# Altium schematic sheet BPF.SchDoc: BPF
size A2 portrait; DocumentNumber: 14; Revision: 1.8.2; SheetNumber: 14; SheetTotal: 19; DocumentName: Лист 1.SCHDOC
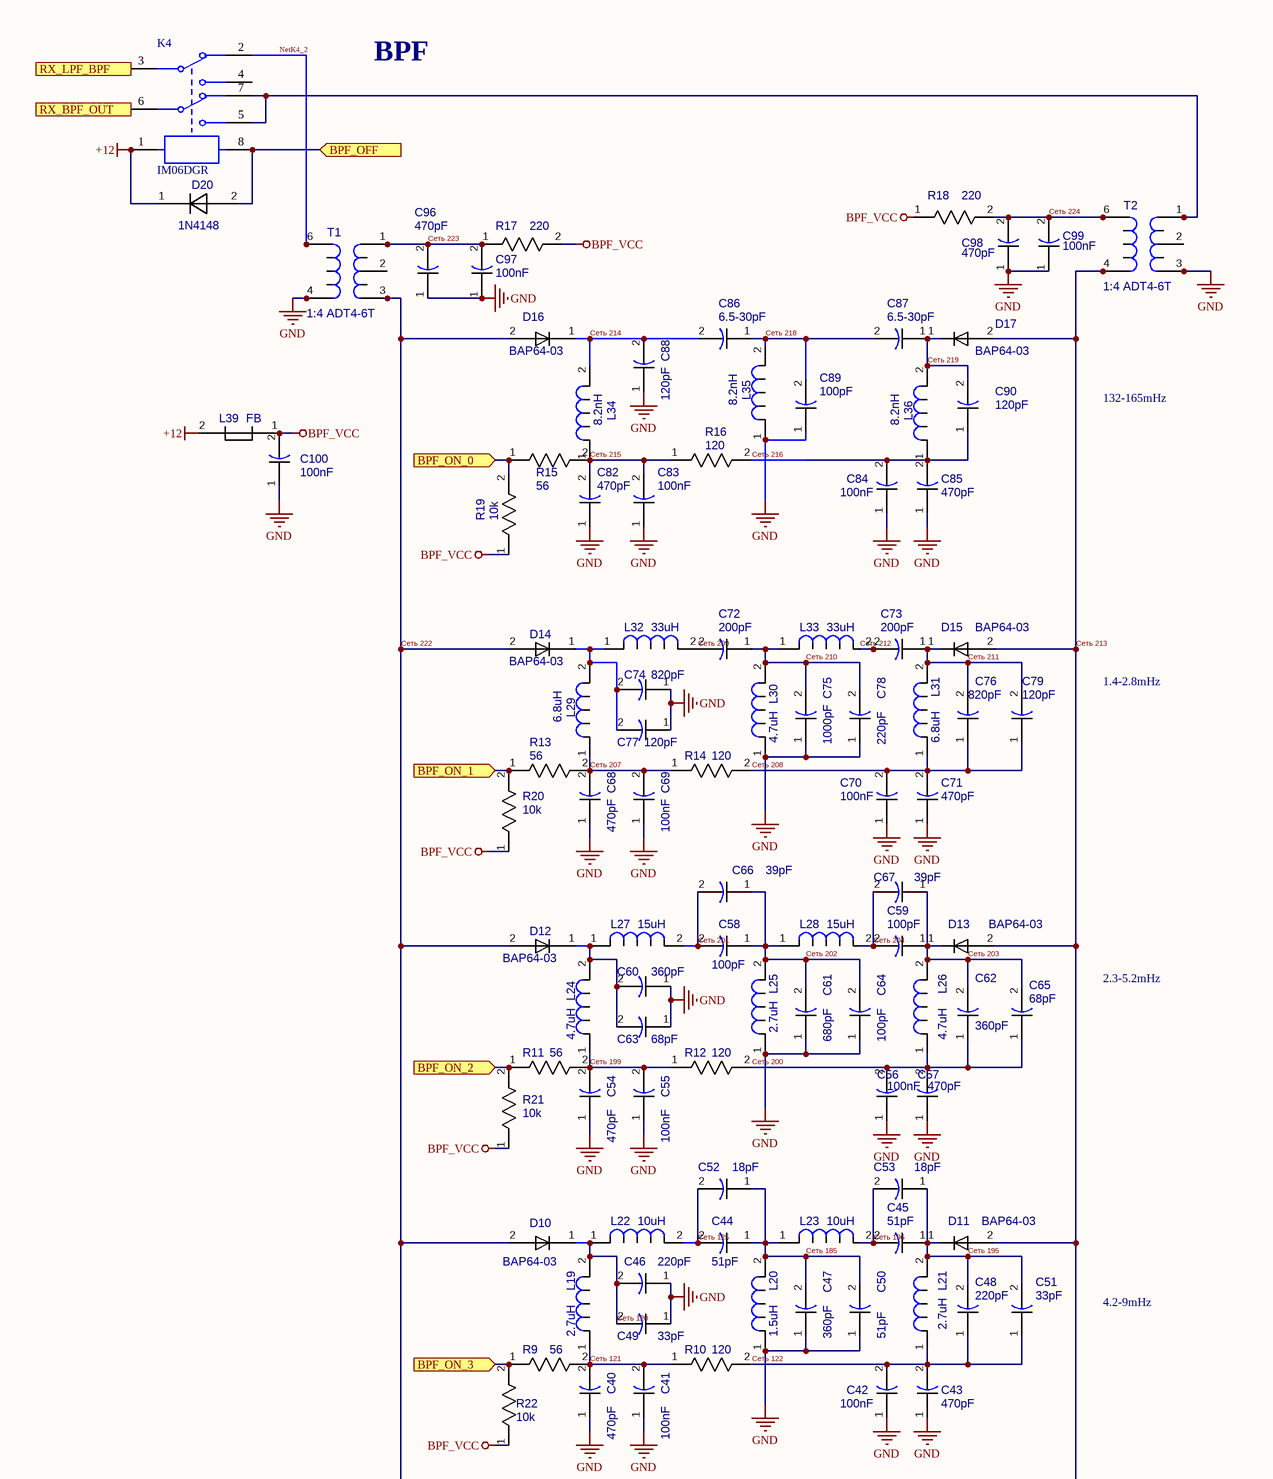
[diagram p0: BPF.SchDoc, top]
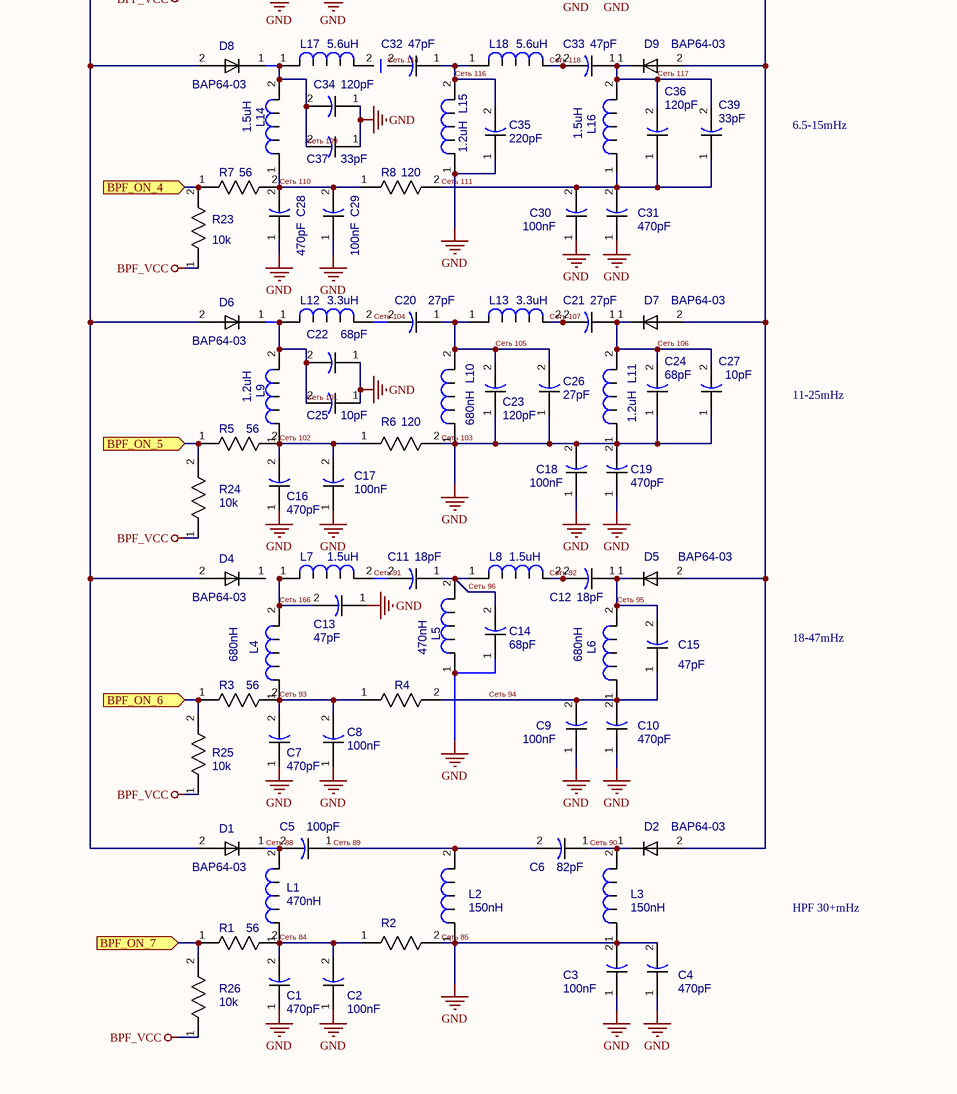
[diagram p1: BPF.SchDoc, bottom]

## Parts
C1  value 470pF  [CAP_0805]  (hidden comment: CAP_0805)
C2  value 100nF  [CAP_0805]  (hidden comment: CAP_0805)
C3  value 100nF  [CAP_0805]  (hidden comment: CAP_0805)
C4  value 470pF  [CAP_0805]  (hidden comment: CAP_0805)
C5  value 100pF  [CAP_0805]  (hidden comment: CAP_0805)
C6  value 82pF  [CAP_0805]  (hidden comment: CAP_0805)
C7  value 470pF  [CAP_0805]  (hidden comment: CAP_0805)
C8  value 100nF  [CAP_0805]  (hidden comment: CAP_0805)
C9  value 100nF  [CAP_0805]  (hidden comment: CAP_0805)
C10  value 470pF  [CAP_0805]  (hidden comment: CAP_0805)
C11  value 18pF  [CAP_0805]  (hidden comment: CAP_0805)
C12  value 18pF  [CAP_0805]  (hidden comment: CAP_0805)
C13  value 47pF  [CAP_0805]  (hidden comment: CAP_0805)
C14  value 68pF  [CAP_0805]  (hidden comment: CAP_0805)
C15  value 47pF  [CAP_0805]  (hidden comment: CAP_0805)
C16  value 470pF  [CAP_0805]  (hidden comment: CAP_0805)
C17  value 100nF  [CAP_0805]  (hidden comment: CAP_0805)
C18  value 100nF  [CAP_0805]  (hidden comment: CAP_0805)
C19  value 470pF  [CAP_0805]  (hidden comment: CAP_0805)
C20  value 27pF  [CAP_0805]  (hidden comment: CAP_0805)
C21  value 27pF  [CAP_0805]  (hidden comment: CAP_0805)
C22  value 68pF  [CAP_0805]  (hidden comment: CAP_0805)
C23  value 120pF  [CAP_0805]  (hidden comment: CAP_0805)
C24  value 68pF  [CAP_0805]  (hidden comment: CAP_0805)
C25  value 10pF  [CAP_0805]  (hidden comment: CAP_0805)
C26  value 27pF  [CAP_0805]  (hidden comment: CAP_0805)
C27  value 10pF  [CAP_0805]  (hidden comment: CAP_0805)
C28  value 470pF  [CAP_0805]  (hidden comment: CAP_0805)
C29  value 100nF  [CAP_0805]  (hidden comment: CAP_0805)
C30  value 100nF  [CAP_0805]  (hidden comment: CAP_0805)
C31  value 470pF  [CAP_0805]  (hidden comment: CAP_0805)
C32  value 47pF  [CAP_0805]  (hidden comment: CAP_0805)
C33  value 47pF  [CAP_0805]  (hidden comment: CAP_0805)
C34  value 120pF  [CAP_0805]  (hidden comment: CAP_0805)
C35  value 220pF  [CAP_0805]  (hidden comment: CAP_0805)
C36  value 120pF  [CAP_0805]  (hidden comment: CAP_0805)
C37  value 33pF  [CAP_0805]  (hidden comment: CAP_0805)
C39  value 33pF  [CAP_0805]  (hidden comment: CAP_0805)
C40  value 470pF  [CAP_0805]  (hidden comment: CAP_0805)
C41  value 100nF  [CAP_0805]  (hidden comment: CAP_0805)
C42  value 100nF  [CAP_0805]  (hidden comment: CAP_0805)
C43  value 470pF  [CAP_0805]  (hidden comment: CAP_0805)
C44  value 51pF  [CAP_0805]  (hidden comment: CAP_0805)
C45  value 51pF  [CAP_0805]  (hidden comment: CAP_0805)
C46  value 220pF  [CAP_0805]  (hidden comment: CAP_0805)
C47  value 360pF  [CAP_0805]  (hidden comment: CAP_0805)
C48  value 220pF  [CAP_0805]  (hidden comment: CAP_0805)
C49  value 33pF  [CAP_0805]  (hidden comment: CAP_0805)
C50  value 51pF  [CAP_0805]  (hidden comment: CAP_0805)
C51  value 33pF  [CAP_0805]  (hidden comment: CAP_0805)
C52  value 18pF  [CAP_0805]  (hidden comment: CAP_0805)
C53  value 18pF  [CAP_0805]  (hidden comment: CAP_0805)
C54  value 470pF  [CAP_0805]  (hidden comment: CAP_0805)
C55  value 100nF  [CAP_0805]  (hidden comment: CAP_0805)
C56  value 100nF  [CAP_0805]  (hidden comment: CAP_0805)
C57  value 470pF  [CAP_0805]  (hidden comment: CAP_0805)
C58  value 100pF  [CAP_0805]  (hidden comment: CAP_0805)
C59  value 100pF  [CAP_0805]  (hidden comment: CAP_0805)
C60  value 360pF  [CAP_0805]  (hidden comment: CAP_0805)
C61  value 680pF  [CAP_0805]  (hidden comment: CAP_0805)
C62  value 360pF  [CAP_0805]  (hidden comment: CAP_0805)
C63  value 68pF  [CAP_0805]  (hidden comment: CAP_0805)
C64  value 100pF  [CAP_0805]  (hidden comment: CAP_0805)
C65  value 68pF  [CAP_0805]  (hidden comment: CAP_0805)
C66  value 39pF  [CAP_0805]  (hidden comment: CAP_0805)
C67  value 39pF  [CAP_0805]  (hidden comment: CAP_0805)
C68  value 470pF  [CAP_0805]  (hidden comment: CAP_0805)
C69  value 100nF  [CAP_0805]  (hidden comment: CAP_0805)
C70  value 100nF  [CAP_0805]  (hidden comment: CAP_0805)
C71  value 470pF  [CAP_0805]  (hidden comment: CAP_0805)
C72  value 200pF  [CAP_0805]  (hidden comment: CAP_0805)
C73  value 200pF  [CAP_0805]  (hidden comment: CAP_0805)
C74  value 820pF  [CAP_0805]  (hidden comment: CAP_0805)
C75  value 1000pF  [CAP_0805]  (hidden comment: CAP_0805)
C76  value 820pF  [CAP_0805]  (hidden comment: CAP_0805)
C77  value 120pF  [CAP_0805]  (hidden comment: CAP_0805)
C78  value 220pF  [CAP_0805]  (hidden comment: CAP_0805)
C79  value 120pF  [CAP_0805]  (hidden comment: CAP_0805)
C82  value 470pF  [CAP_0805]  (hidden comment: CAP_0805)
C83  value 100nF  [CAP_0805]  (hidden comment: CAP_0805)
C84  value 100nF  [CAP_0805]  (hidden comment: CAP_0805)
C85  value 470pF  [CAP_0805]  (hidden comment: CAP_0805)
C86  value 6.5-30pF  [CAP_1206]  (hidden comment: CAP_0805)
C87  value 6.5-30pF  [CAP_1206]  (hidden comment: CAP_0805)
C88  value 120pF  [CAP_0805]  (hidden comment: CAP_0805)
C89  value 100pF  [CAP_0805]  (hidden comment: CAP_0805)
C90  value 120pF  [CAP_0805]  (hidden comment: CAP_0805)
C96  value 470pF  [CAP_0805]  (hidden comment: CAP_0805)
C97  value 100nF  [CAP_0805]  (hidden comment: CAP_0805)
C98  value 470pF  [CAP_0805]  (hidden comment: CAP_0805)
C99  value 100nF  [CAP_0805]  (hidden comment: CAP_0805)
C100  value 100nF  [CAP_0805]  (hidden comment: CAP_0805)
D1  BAP64-03  [SOD-323]
D2  BAP64-03  [SOD-323]
D4  BAP64-03  [SOD-323]
D5  BAP64-03  [SOD-323]
D6  BAP64-03  [SOD-323]
D7  BAP64-03  [SOD-323]
D8  BAP64-03  [SOD-323]
D9  BAP64-03  [SOD-323]
D10  BAP64-03  [SOD-323]
D11  BAP64-03  [SOD-323]
D12  BAP64-03  [SOD-323]
D13  BAP64-03  [SOD-323]
D14  BAP64-03  [SOD-323]
D15  BAP64-03  [SOD-323]
D16  BAP64-03  [SOD-323]
D17  BAP64-03  [SOD-323]
D20  1N4148  [1N4148]
K4  IM06DGR  [TECO-SMT-8_V]
L1  value 470nH  [IND_0805]  (hidden comment: IND_0805)
L2  value 150nH  [IND_0805]  (hidden comment: IND_0805)
L3  value 150nH  [IND_0805]  (hidden comment: IND_0805)
L4  value 680nH  [IND_0805]  (hidden comment: IND_0805)
L5  value 470nH  [IND_0805]  (hidden comment: IND_0805)
L6  value 680nH  [IND_0805]  (hidden comment: IND_0805)
L7  value 1.5uH  [IND_0805]  (hidden comment: IND_0805)
L8  value 1.5uH  [IND_0805]  (hidden comment: IND_0805)
L9  value 1.2uH  [IND_0805]  (hidden comment: IND_0805)
L10  value 680nH  [IND_0805]  (hidden comment: IND_0805)
L11  value 1.2uH  [IND_0805]  (hidden comment: IND_0805)
L12  value 3.3uH  [IND_0805]  (hidden comment: IND_0805)
L13  value 3.3uH  [IND_0805]  (hidden comment: IND_0805)
L14  value 1.5uH  [IND_0805]  (hidden comment: IND_0805)
L15  value 1.2uH  [IND_0805]  (hidden comment: IND_0805)
L16  value 1.5uH  [IND_0805]  (hidden comment: IND_0805)
L17  value 5.6uH  [IND_0805]  (hidden comment: IND_0805)
L18  value 5.6uH  [IND_0805]  (hidden comment: IND_0805)
L19  value 2.7uH  [IND_0805]  (hidden comment: IND_0805)
L20  value 1.5uH  [IND_0805]  (hidden comment: IND_0805)
L21  value 2.7uH  [IND_0805]  (hidden comment: IND_0805)
L22  value 10uH  [IND_0805]  (hidden comment: IND_0805)
L23  value 10uH  [IND_0805]  (hidden comment: IND_0805)
L24  value 4.7uH  [IND_0805]  (hidden comment: IND_0805)
L25  value 2.7uH  [IND_0805]  (hidden comment: IND_0805)
L26  value 4.7uH  [IND_0805]  (hidden comment: IND_0805)
L27  value 15uH  [IND_0805]  (hidden comment: IND_0805)
L28  value 15uH  [IND_0805]  (hidden comment: IND_0805)
L29  value 6.8uH  [IND_0805]  (hidden comment: IND_0805)
L30  value 4.7uH  [IND_0805]  (hidden comment: IND_0805)
L31  value 6.8uH  [IND_0805]  (hidden comment: IND_0805)
L32  value 33uH  [IND_0805]  (hidden comment: IND_0805)
L33  value 33uH  [IND_0805]  (hidden comment: IND_0805)
L34  value 8.2nH  [IND_0805]  (hidden comment: IND_0805)
L35  value 8.2nH  [IND_0805]  (hidden comment: IND_0805)
L36  value 8.2nH  [IND_0805]  (hidden comment: IND_0805)
L39  value FB  [IND_FERRITE_BEAD]  (hidden comment: IND_FERRITE_BEAD)
R1  value 56  [RES_0805]  (hidden comment: RES_0805)
R2  RES_0805  [RES_0805]  (value not drawn)
R3  value 56  [RES_0805]  (hidden comment: RES_0805)
R4  RES_0805  [RES_0805]  (value not drawn)
R5  value 56  [RES_0805]  (hidden comment: RES_0805)
R6  value 120  [RES_0805]  (hidden comment: RES_0805)
R7  value 56  [RES_0805]  (hidden comment: RES_0805)
R8  value 120  [RES_0805]  (hidden comment: RES_0805)
R9  value 56  [RES_0805]  (hidden comment: RES_0805)
R10  value 120  [RES_0805]  (hidden comment: RES_0805)
R11  value 56  [RES_0805]  (hidden comment: RES_0805)
R12  value 120  [RES_0805]  (hidden comment: RES_0805)
R13  value 56  [RES_0805]  (hidden comment: RES_0805)
R14  value 120  [RES_0805]  (hidden comment: RES_0805)
R15  value 56  [RES_0805]  (hidden comment: RES_0805)
R16  value 120  [RES_0805]  (hidden comment: RES_0805)
R17  value 220  [RES_0805]  (hidden comment: RES_0805)
R18  value 220  [RES_0805]  (hidden comment: RES_0805)
R19  value 10k  [RES_0805]  (hidden comment: RES_0805)
R20  value 10k  [RES_0805]  (hidden comment: RES_0805)
R21  value 10k  [RES_0805]  (hidden comment: RES_0805)
R22  value 10k  [RES_0805]  (hidden comment: RES_0805)
R23  value 10k  [RES_0805]  (hidden comment: RES_0805)
R24  value 10k  [RES_0805]  (hidden comment: RES_0805)
R25  value 10k  [RES_0805]  (hidden comment: RES_0805)
R26  value 10k  [RES_0805]  (hidden comment: RES_0805)
T1  value 1:4 ADT4-6T  [TRANSF_ACORE2]  (hidden comment: TRANSF_ACORE2)
T2  value 1:4 ADT4-6T  [TRANSF_ACORE2]  (hidden comment: TRANSF_ACORE2)

## Ports
BPF_OFF (in), BPF_ON_0 (in), BPF_ON_1 (in), BPF_ON_2 (in), BPF_ON_3 (in), BPF_ON_4 (in), BPF_ON_5 (in), BPF_ON_6 (in), BPF_ON_7 (in), RX_BPF_OUT (out), RX_LPF_BPF (in)

## Nets
+12: D20.1(K) K4.1 L39.2
BPF_VCC: C100.2 L39.1 R17.2 R18.1 R19.1 R20.1 R21.1 R22.1 R23.1 R24.1 R25.1 R26.1
Сеть 103: C1.1 C2.1 C3.1 C3.2 C4.1 C4.2 C7.1 C8.1 C9.1 C10.1 C13.1 C14.1 C16.1 C17.1 C18.1 C18.2 C19.1 C19.2 C22.1 C23.1 C24.1 C25.1 C26.1 C27.1 C28.1 C29.1 C30.1 C31.1 C34.1 C35.1 C37.1 C40.1 C41.1 C42.1 C43.1 C46.1 C47.1 C49.1 C50.1 C54.1 C55.1 C56.1 C57.1 C60.1 C61.1 C63.1 C64.1 C68.1 C69.1 C70.1 C71.1 C74.1 C75.1 C77.1 C78.1 C82.1 C83.1 C84.1 C85.1 C88.1 C89.1 C96.1 C97.1 C98.1 C99.1 C100.1 L2.1 L3.1 L5.1 L10.1 L11.1 L15.1 L20.1 L25.1 L30.1 L35.1 R2.2 R6.2 T1.4(P1) T1.11 T2.3(S1) T2.9  [also labelled GND, Сеть 85]
BPF_OFF: D20.2(A) K4.8 ; port BPF_OFF
BPF_ON_0: R15.1 R19.2 ; port BPF_ON_0
BPF_ON_1: R13.1 R20.2 ; port BPF_ON_1
BPF_ON_2: R11.1 R21.2 ; port BPF_ON_2
BPF_ON_3: R9.1 R22.2 ; port BPF_ON_3
BPF_ON_4: R7.1 R23.2 ; port BPF_ON_4
BPF_ON_5: R5.1 R24.2 ; port BPF_ON_5
BPF_ON_6: R3.1 R25.2 ; port BPF_ON_6
BPF_ON_7: R1.1 R26.2 ; port BPF_ON_7
NetK4_2: K4.2 T1.6(P2) T1.10
RX_BPF_OUT: K4.6 ; port RX_BPF_OUT
RX_LPF_BPF: K4.3 ; port RX_LPF_BPF
Сеть 84: C1.2 C2.2 L1.1 R1.2 R2.1
Сеть 88: C5.2 D1.1((C)) L1.2
Сеть 89: C5.1 C6.2 L2.2
Сеть 90: C6.1 D2.1((C)) L3.2
Сеть 91: C11.2 L7.2
Сеть 92: C12.2 L8.2
Сеть 93: C7.2 C8.2 L4.1 R3.2 R4.1
Сеть 94: C9.2 C10.2 C15.1 L6.1 R4.2
Сеть 95: C12.1 C15.2 D5.1((C)) L6.2
Сеть 96: C11.1 C14.2 L5.2 L8.1
Сеть 101: C22.2 C25.2 D6.1((C)) L9.2 L12.1
Сеть 102: C16.2 C17.2 L9.1 R5.2 R6.1
Сеть 104: C20.2 L12.2
Сеть 105: C20.1 C23.2 C26.2 L10.2 L13.1
Сеть 106: C21.1 C24.2 C27.2 D7.1((C)) L11.2
Сеть 107: C21.2 L13.2
Сеть 109: C34.2 C37.2 D8.1((C)) L14.2 L17.1
Сеть 110: C28.2 C29.2 L14.1 R7.2 R8.1
Сеть 111: C30.2 C31.2 C36.1 C39.1 L16.1 R8.2
Сеть 114: C32.2
Сеть 116: C32.1 C35.2 L15.2 L18.1
Сеть 117: C33.1 C36.2 C39.2 D9.1((C)) L16.2
Сеть 118: C33.2 L18.2
Сеть 120: C46.2 C49.2 D10.1((C)) L19.2 L22.1
Сеть 121: C40.2 C41.2 L19.1 R9.2 R10.1
Сеть 122: C42.2 C43.2 C48.1 C51.1 L21.1 R10.2
Сеть 125: C44.2 C52.2 L22.2
Сеть 166: C13.2 L4.2 L7.1
Сеть 185: C44.1 C47.2 C50.2 C52.1 L20.2 L23.1
Сеть 195: C45.1 C48.2 C51.2 C53.1 D11.1((C)) L21.2
Сеть 196: C45.2 C53.2 L23.2
Сеть 199: C54.2 C55.2 L24.1 R11.2 R12.1
Сеть 200: C56.2 C57.2 C62.1 C65.1 L26.1 R12.2
Сеть 201: C58.2 C66.2 L27.2
Сеть 202: C58.1 C61.2 C64.2 C66.1 L25.2 L28.1
Сеть 203: C59.1 C62.2 C65.2 C67.1 D13.1((C)) L26.2
Сеть 204: C59.2 C67.2 L28.2
Сеть 207: C68.2 C69.2 L29.1 R13.2 R14.1
Сеть 208: C70.2 C71.2 C76.1 C79.1 L31.1 R14.2
Сеть 209: C72.2 L32.2
Сеть 210: C72.1 C75.2 C78.2 L30.2 L33.1
Сеть 211: C73.1 C76.2 C79.2 D15.1((C)) L31.2
Сеть 212: C73.2 L33.2
Сеть 213: D2.2((A)) D5.2((A)) D7.2((A)) D9.2((A)) D11.2((A)) D13.2((A)) D15.2((A)) D17.2((A)) T2.4(P1) T2.11
Сеть 214: C86.2 C88.2 D16.1((C)) L34.2
Сеть 215: C82.2 C83.2 L34.1 R15.2 R16.1
Сеть 216: C84.2 C85.2 C90.1 L36.1 R16.2
Сеть 218: C86.1 C87.2 C89.2 L35.2
Сеть 219: C87.1 C90.2 D17.1((C)) L36.2
Сеть 222: D1.2((A)) D4.2((A)) D6.2((A)) D8.2((A)) D10.2((A)) D12.2((A)) D14.2((A)) D16.2((A)) T1.3(S1) T1.9
Сеть 223: C96.2 C97.2 R17.1 T1.1(S3) T1.7
Сеть 224: C98.2 C99.2 R18.2 T2.6(P2) T2.10
NetC60_2: C60.2 C63.2 D12.1((C)) L24.2 L27.1
NetC74_2: C74.2 C77.2 D14.1((C)) L29.2 L32.1
NetK4_5: K4.5 K4.7 T2.1(S3) T2.7

Not connected (* = marked no-connect by the designer): D4 1((C)); K4 4; L17 2; T1 2(S2); T2 2(S2)

## Notes on the sheet
- BPF
- 132-165mHz
- 1.4-2.8mHz
- 2.3-5.2mHz
- 4.2-9mHz
- 6.5-15mHz
- 11-25mHz
- 18-47mHz
- HPF 30+mHz
- Title
- Size:
- Date:
- File:
- A2
- Number:
- Time:
- Revision:
- Sheet
- of

## Library data of the parts
K4 = CMP-2000-05421-1: Signal Relay, 5 A, 12 VDC, -40 to 85 degC, 8-Pin SMD, RoHS, Tape and Reel; Manufacturer: TE Connectivity; Contact Voltage AC Nom: 250V; Approval Category: ULRecognised; Contact Current Max: 5A; Coil Type: DC; Coil Voltage VDC Nom: 12V; Dielectric Voltage Coil to Contact: 1800V; Switching Power Max: 62.5VA; Switching Voltage AC / DC Max: 250VAC; External Depth: 10mm; Approval Bodies: EN/IEC; No. of Pins: 8; Contact Configuration: DPCO; Contact Voltage DC Nom: 220V; Coil Resistance: 1.028kohm; Coil Power Cont: 140mW; Dielectric Voltage Contact to Contact: 1000V; Contact Current DC Max: 2A; Switching Voltage Max: 220VDC; Insulation Resistance: 1000Mohm; No. of Poles: 2; Switching Voltage AC / DC Min: 100µV; Contact Resistance: 50mohm; External Width: 6mm; Switch Power Max: 60W; Operating Voltage Range: 9Vto28.9V; Insulation Resistance Voltage: 500VDC; External Length / Height: 5.65mm; Relay Mounting: SMD; Package Reference: SMT-8; Datasheet URL: http://www.farnell.com/datasheets/1717896.pdf; Manufacturer URL: http://www.te.com/; Operating Temperature Max: 85degC; Series: IM; Mounting Type: SMT; Package Description: 8-Pin Surface Mount Device, Body 10 x 6 mm; DC Coil Power: 140mW; MSL: MSL3-168hours; Contact Current AC Max: 2A; Datasheet Version: Rev. 0411, 04/2011; Operating Temperature Min: -40degC; External Height: 5.65mm
L39 = IND_FERRITE_BEAD: Ferrite bead on conductor
R2 R4 = RES_0805: Value: 120
T1 T2 = TRANSF_ACORE2: Transformer
D1 D2 D4-D17 = BAP64-03: Value: BAP64-03
D20 = 1N4148: Value: 1N4148